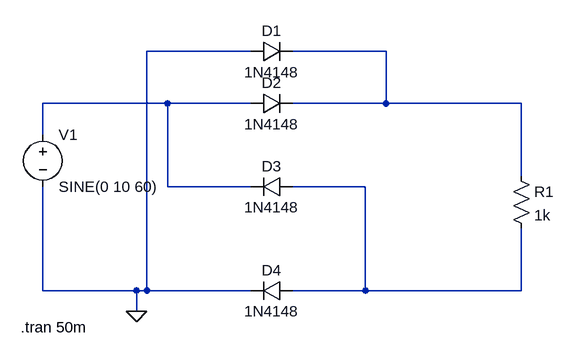
[diagram p0: schematic Full_Bridge_2.asc]
Full_Bridge_2.asc, the LTspice schematic file:
Version 4
SHEET 1 880 680
WIRE 128 48 -32 48
WIRE 336 48 192 48
WIRE 0 128 -192 128
WIRE 128 128 0 128
WIRE 336 128 336 48
WIRE 336 128 192 128
WIRE 544 128 336 128
WIRE -192 176 -192 128
WIRE 544 240 544 128
WIRE 0 256 0 128
WIRE 128 256 0 256
WIRE 304 256 192 256
WIRE -192 416 -192 256
WIRE -48 416 -192 416
WIRE -32 416 -32 48
WIRE -32 416 -48 416
WIRE 128 416 -32 416
WIRE 304 416 304 256
WIRE 304 416 192 416
WIRE 544 416 544 320
WIRE 544 416 304 416
WIRE -48 448 -48 416
FLAG -48 448 0
SYMBOL diode 128 64 R270
WINDOW 0 32 32 VTop 2
WINDOW 3 0 32 VBottom 2
SYMATTR InstName D1
SYMATTR Value 1N4148
SYMBOL diode 128 144 R270
WINDOW 0 32 32 VTop 2
WINDOW 3 0 32 VBottom 2
SYMATTR InstName D2
SYMATTR Value 1N4148
SYMBOL diode 192 240 R90
WINDOW 0 0 32 VBottom 2
WINDOW 3 32 32 VTop 2
SYMATTR InstName D3
SYMATTR Value 1N4148
SYMBOL diode 192 400 R90
WINDOW 0 0 32 VBottom 2
WINDOW 3 32 32 VTop 2
SYMATTR InstName D4
SYMATTR Value 1N4148
SYMBOL res 528 224 R0
SYMATTR InstName R1
SYMATTR Value 1k
SYMBOL voltage -192 160 R0
WINDOW 123 0 0 Left 0
WINDOW 39 0 0 Left 0
SYMATTR InstName V1
SYMATTR Value SINE(0 10 60)
TEXT -226 472 Left 2 !.tran 50m

The netlist it stands for:
* Full_Bridge_2.asc
D1 0 N001 1N4148
D2 N002 N001 1N4148
D3 N003 N002 1N4148
D4 N003 0 1N4148
R1 N001 N003 1k
V1 N002 0 SINE(0 10 60)
.model D D
.lib standard.dio
.tran 50m
.backanno
.end